# Altium project steve.PrjPcb (part 1 of 3)
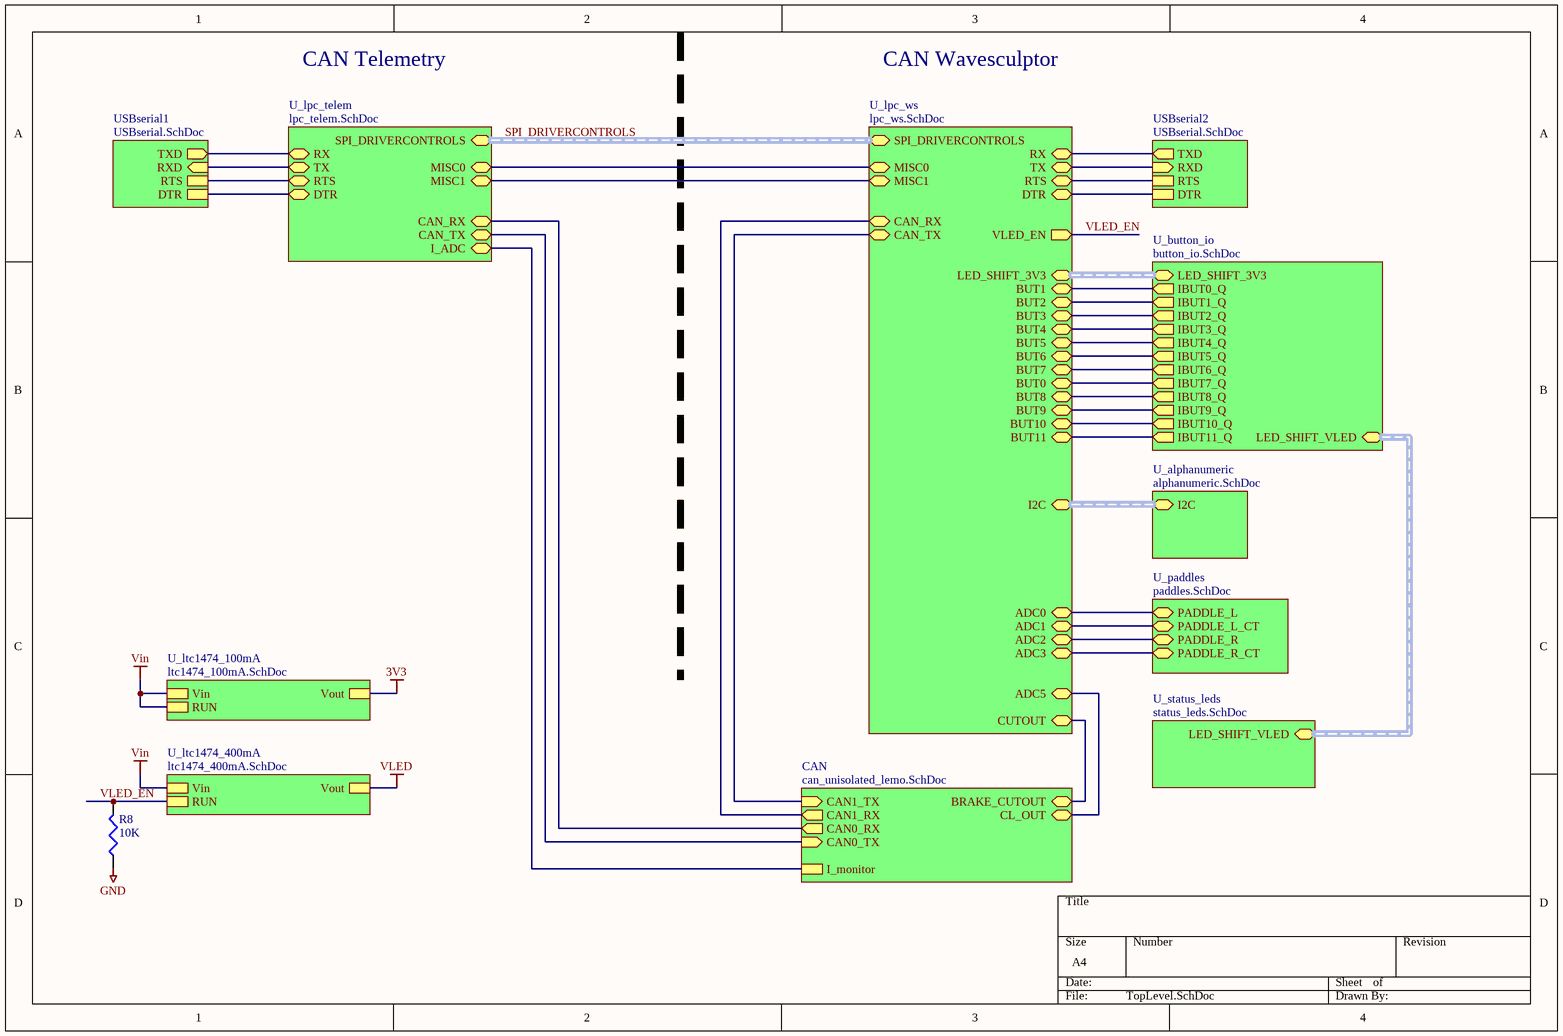
[diagram p0: TopLevel.SchDoc]
13 sheets, 286 parts. Net scope: hierarchical (ports join the sheet entries above them; power ports are global).
Board file: steve.PcbDoc
Sheets:
  TopLevel.SchDoc
    CAN = can_unisolated_lemo.SchDoc
    USBserial1 = USBserial.SchDoc
    USBserial2 = USBserial.SchDoc
    U_lpc_telem = lpc_telem.SchDoc
      U_lpc11c14 = lpc11c14.SchDoc
    U_lpc_ws = lpc_ws.SchDoc
      U_lpc11c14 = lpc11c14.SchDoc
    U_button_io = button_io.SchDoc
      U_IBUT0 = illuminated_button.SchDoc
      U_IBUT1 = illuminated_button.SchDoc
      U_IBUT2 = illuminated_button.SchDoc
      U_IBUT3 = illuminated_button.SchDoc
      U_IBUT4 = illuminated_button.SchDoc
      U_IBUT5 = illuminated_button.SchDoc
      U_IBUT6 = illuminated_button.SchDoc
      U_IBUT7 = illuminated_button.SchDoc
      U_IBUT8 = illuminated_button.SchDoc
      U_IBUT9 = illuminated_button.SchDoc
      U_IBUT10 = illuminated_button.SchDoc
      U_IBUT11 = illuminated_button.SchDoc
    U_alphanumeric = alphanumeric.SchDoc
    U_paddles = paddles.SchDoc
    U_ltc1474_100mA = ltc1474_100mA.SchDoc
    U_ltc1474_400mA = ltc1474_400mA.SchDoc
    U_status_leds = status_leds.SchDoc

## Sheet TopLevel.SchDoc
size A4

### Parts
R8  10K  [0603]

### Sub-sheets
CAN = can_unisolated_lemo.SchDoc: I_monitor, CAN0_TX (in), CAN0_RX (out), CAN1_TX (in), CAN1_RX (out), CL_OUT, BRAKE_CUTOUT
U_alphanumeric = alphanumeric.SchDoc: I2C (harness I2C)
U_button_io = button_io.SchDoc: LED_SHIFT_3V3 (harness LED_SHIFT), IBUT0_Q (out), IBUT1_Q (out), IBUT2_Q (out), IBUT3_Q (out), IBUT4_Q (out), IBUT5_Q (out), IBUT6_Q (out), IBUT7_Q (out), IBUT8_Q (out), IBUT9_Q (out), IBUT10_Q (out), IBUT11_Q (out), LED_SHIFT_VLED (harness LED_SHIFT_RET)
U_lpc_telem = lpc_telem.SchDoc: RX, TX, RTS, DTR, CAN_RX, CAN_TX, I_ADC, SPI_DRIVERCONTROLS (harness SPI), MISC0, MISC1
U_lpc_ws = lpc_ws.SchDoc: RX, TX, RTS, DTR, CAN_RX, CAN_TX, SPI_DRIVERCONTROLS (harness SPI), LED_SHIFT_3V3 (harness LED_SHIFT), VLED_EN (out), I2C (harness I2C), BUT1, BUT2, BUT3, BUT4, BUT5, BUT6, BUT7, BUT0, BUT8, BUT9, BUT10, BUT11, ADC0, ADC1, ADC2, ADC3, ADC5, CUTOUT, MISC0, MISC1
U_ltc1474_100mA = ltc1474_100mA.SchDoc: Vin, Vout, RUN
U_ltc1474_400mA = ltc1474_400mA.SchDoc: Vin, Vout, RUN
U_paddles = paddles.SchDoc: PADDLE_L, PADDLE_L_CT, PADDLE_R, PADDLE_R_CT
U_status_leds = status_leds.SchDoc: LED_SHIFT_VLED (harness LED_SHIFT_RET)
USBserial1 = USBserial.SchDoc: TXD (out), RXD (in), DTR, RTS
USBserial2 = USBserial.SchDoc: TXD (out), RXD (in), DTR, RTS

### Nets
GND: R8.1
Vin: sheet U_ltc1474_100mA/Vin, sheet U_ltc1474_100mA/RUN, sheet U_ltc1474_400mA/Vin
CAN_RX: sheet CAN/CAN0_RX, sheet U_lpc_telem/CAN_RX
CAN_RX: sheet CAN/CAN1_RX, sheet U_lpc_ws/CAN_RX  [a separate net that carries the same name]
CAN_TX: sheet CAN/CAN1_TX, sheet U_lpc_ws/CAN_TX
CAN_TX: sheet CAN/CAN0_TX, sheet U_lpc_telem/CAN_TX  [a separate net that carries the same name]
PIO 0.6: sheet U_lpc_ws/BUT9, sheet U_button_io/IBUT9_Q
PIO 0.7: sheet U_lpc_ws/BUT11, sheet U_button_io/IBUT11_Q
PIO 0.8/MISO0: sheet U_lpc_ws/BUT10, sheet U_button_io/IBUT10_Q
PIO 0.11/ADC0: sheet U_lpc_ws/ADC0, sheet U_paddles/PADDLE_L
PIO 1.0/ADC1: sheet U_lpc_ws/ADC1, sheet U_paddles/PADDLE_L_CT
PIO 1.1/ADC2: sheet U_lpc_ws/ADC2, sheet U_paddles/PADDLE_R
PIO 1.2/ADC3: sheet U_lpc_ws/ADC3, sheet U_paddles/PADDLE_R_CT
PIO 1.4/ADC5/WAKEUP: sheet CAN/CL_OUT, sheet U_lpc_ws/ADC5
PIO 1.5: sheet U_lpc_ws/BUT4, sheet U_button_io/IBUT3_Q
PIO 1.6/RX: sheet USBserial1/TXD, sheet U_lpc_telem/RX
PIO 1.6/RX: sheet USBserial2/TXD, sheet U_lpc_ws/RX  [a separate net that carries the same name]
PIO 1.7/TX: sheet USBserial1/RXD, sheet U_lpc_telem/TX
PIO 1.7/TX: sheet USBserial2/RXD, sheet U_lpc_ws/TX  [a separate net that carries the same name]
PIO 1.8: sheet U_lpc_ws/BUT5, sheet U_button_io/IBUT4_Q
PIO 1.9: sheet U_lpc_ws/BUT6, sheet U_button_io/IBUT5_Q
PIO 1.10/ADC6: sheet CAN/I_monitor, sheet U_lpc_telem/I_ADC
PIO 1.11/ADC7: sheet U_lpc_ws/BUT7, sheet U_button_io/IBUT6_Q
PIO 2.5: sheet U_lpc_ws/BUT0, sheet U_button_io/IBUT7_Q
PIO 2.6: sheet U_lpc_ws/BUT1, sheet U_button_io/IBUT0_Q
PIO 2.7: sheet U_lpc_ws/BUT2, sheet U_button_io/IBUT1_Q
PIO 2.8: sheet U_lpc_ws/BUT3, sheet U_button_io/IBUT2_Q
PIO 2.9: sheet CAN/BRAKE_CUTOUT, sheet U_lpc_ws/CUTOUT
PIO 2.10: sheet U_lpc_ws/BUT8, sheet U_button_io/IBUT8_Q
PIO 3.2: sheet U_lpc_telem/MISC0, sheet U_lpc_ws/MISC0
PIO 3.3: sheet U_lpc_telem/MISC1, sheet U_lpc_ws/MISC1
VLED_EN: R8.2 ; sheet U_lpc_ws/VLED_EN, sheet U_ltc1474_400mA/RUN
NetR2_U_lpc_telem_U_lpc11c14_1: sheet USBserial1/DTR, sheet U_lpc_telem/DTR
NetR2_U_lpc_ws_U_lpc11c14_1: sheet USBserial2/DTR, sheet U_lpc_ws/DTR
NetR4_U_lpc_telem_U_lpc11c14_1: sheet USBserial1/RTS, sheet U_lpc_telem/RTS
NetR4_U_lpc_ws_U_lpc11c14_1: sheet USBserial2/RTS, sheet U_lpc_ws/RTS

### Buses and harness runs
harness sheet U_alphanumeric/I2C = sheet U_lpc_ws/I2C
harness sheet U_button_io/LED_SHIFT_3V3 = sheet U_lpc_ws/LED_SHIFT_3V3
harness sheet U_button_io/LED_SHIFT_VLED = sheet U_status_leds/LED_SHIFT_VLED
harness SPI_DRIVERCONTROLS = sheet U_lpc_telem/SPI_DRIVERCONTROLS = sheet U_lpc_ws/SPI_DRIVERCONTROLS

### Notes on the sheet
- CAN Telemetry
- CAN Wavesculptor

### Library data of the parts
R8 = RES1: Resistor; Value: 1k; Needed?: NO - HW LAB

## Sheet can_unisolated_lemo.SchDoc
size A4; Organization: UNSW Solar Racing Team; Address3: UNSW; Address4: Sydney NSW 2052; Address2: Electrical Engineering; Address1: Rm 109
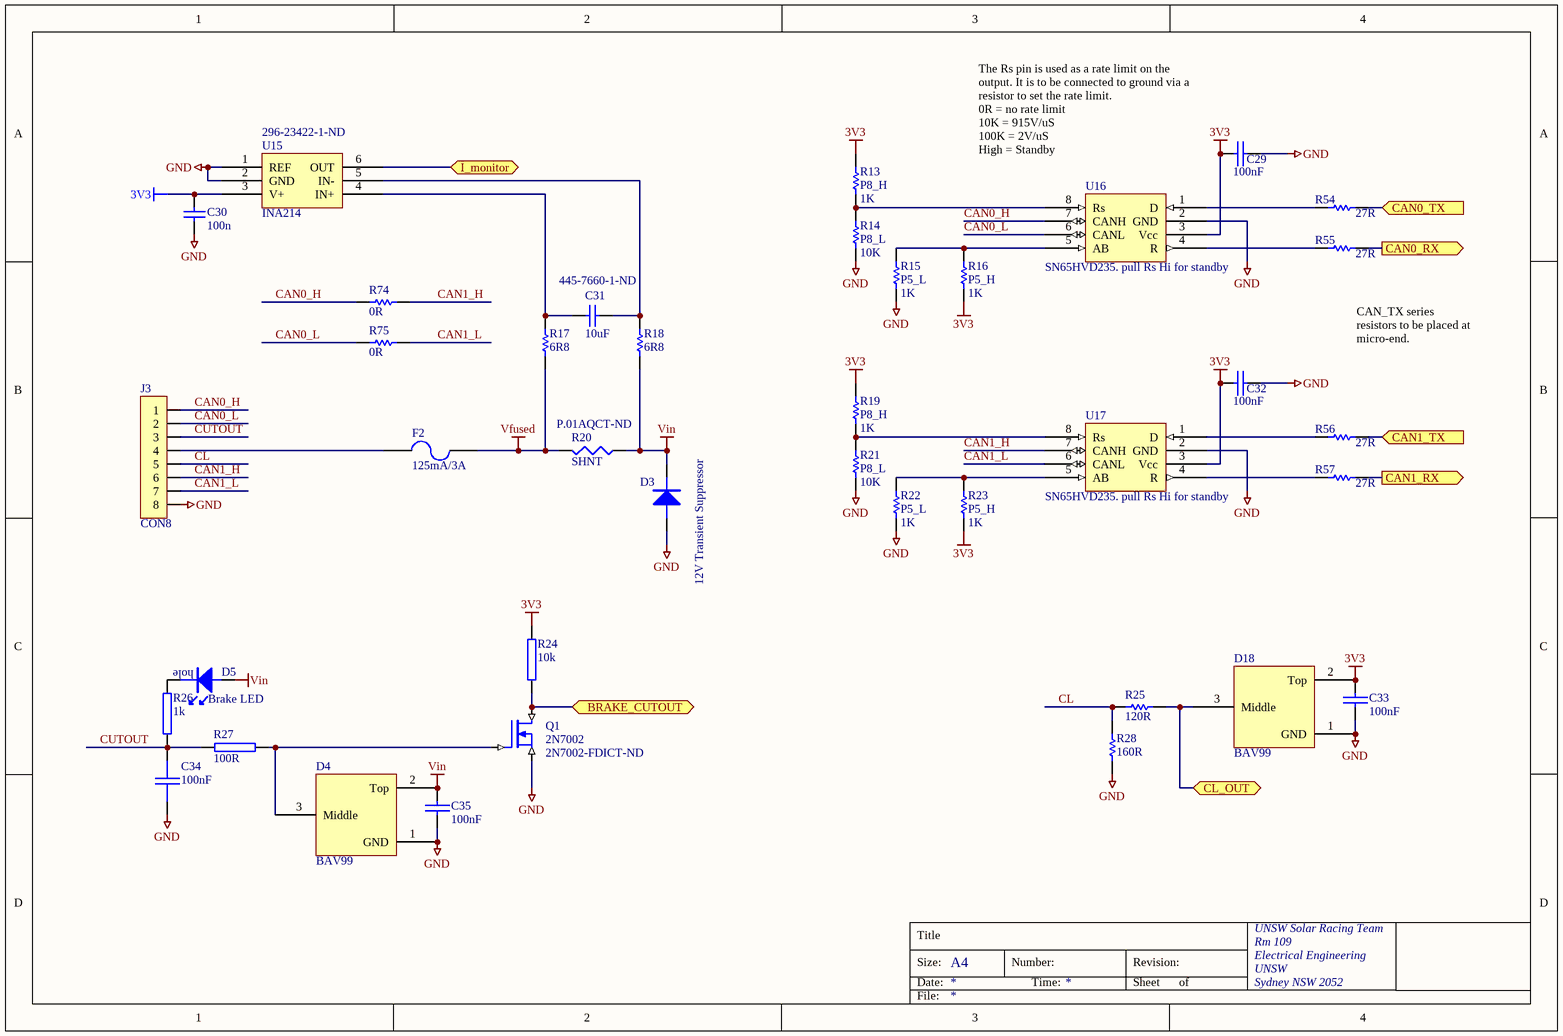
[diagram p1: can_unisolated_lemo.SchDoc]

### Parts
C29  100nF  [0603]
C30  100n  [0603]
C31  10uF  Supplier Part Number 1: 445-7660-1-ND  [0805]
C32  100nF  [0603]
C33  100nF  [0603]
C34  100nF  [0603]
C35  100nF  [0603]
D3  12V Transient Suppressor  [SMA]
D4  BAV99  [SOT23-3]
D5  Brake LED  [LED0.1]
D18  BAV99  [SOT23-3]
F2  125mA/3A  [LITTELFUSE-154]
J3  CON8  [LEMO_1B_308]
Q1  2N7002  Supplier Part Number 1: 2N7002-FDICT-ND  [SOT23-3]
R13  P8_H  value 1K  [0603]
R14  P8_L  value 10K  [0603]
R15  P5_L  value 1K  [0603]
R16  P5_H  value 1K  [0603]
R17  6R8  [0603]
R18  6R8  [0603]
R19  P8_H  value 1K  [0603]
R20  SHNT  Supplier Part Number 1: P.01AQCT-ND  [0805]
R21  P8_L  value 10K  [0603]
R22  P5_L  value 1K  [0603]
R23  P5_H  value 1K  [0603]
R24  10k  [0603]
R25  120R  [0603]
R26  1k  [0603]
R27  100R  [0603]
R28  160R  [0603]
R54  27R  [0603]
R55  27R  [0603]
R56  27R  [0603]
R57  27R  [0603]
R74  0R  [0603]
R75  0R  [0603]
U15  INA214  Supplier Part Number 1: 296-23422-1-ND  [SC70-6]
U16  SN65HVD235. pull Rs Hi for standby  [SO8]
U17  SN65HVD235. pull Rs Hi for standby  [SO8]

### Ports
BRAKE_CUTOUT, CAN0_RX (out), CAN0_TX (in), CAN1_RX (out), CAN1_TX (in), CL_OUT, I_monitor

### Nets
3V3: C29.2 C30.2 C32.2 C33.1 D18.2(Top) R13.2 R16.1 R19.2 R23.1 R24.2 U15.3(V+) U16.3(Vcc) U17.3(Vcc)
GND: C29.1 C30.1 C32.1 C33.2 C34.2 C35.2 D3.A D4.1(GND) D18.1(GND) J3.8 Q1.S R14.1 R15.1 R21.1 R22.1 R28.1 U15.1(REF) U15.2(GND) U16.2(GND) U17.2(GND)
Vfused: F2.2 R17.2 R20.2
Vin: C35.1 D3.K D4.2(Top) D5.A R18.2 R20.1
CAN0_H: J3.1 R74.1 U16.7(CANH)
CAN0_L: J3.2 R75.1 U16.6(CANL)
CAN1_H: J3.6 R74.2 U17.7(CANH)
CAN1_L: J3.7 R75.2 U17.6(CANL)
CAN_RX: R55.1 ; port CAN0_RX
CAN_RX: R57.1 ; port CAN1_RX  [a separate net that carries the same name]
CAN_TX: R56.1 ; port CAN1_TX
CAN_TX: R54.1 ; port CAN0_TX  [a separate net that carries the same name]
CL: J3.5 R25.2 R28.2
CUTOUT: C34.1 J3.3 R26.2 R27.1
PIO 1.4/ADC5/WAKEUP: D18.3(Middle) R25.1 ; port CL_OUT
PIO 1.10/ADC6: U15.6(OUT) ; port I_monitor
PIO 2.9: Q1.D R24.1 ; port BRAKE_CUTOUT
NetC31_1: C31.1 R17.1 U15.4(IN+)
NetC31_2: C31.2 R18.1 U15.5(IN-)
NetD4_3: D4.3(Middle) Q1.G R27.2
NetD5_K: D5.K R26.1
NetF2_1: F2.1 J3.4
NetR13_1: R13.1 R14.2 U16.8(Rs)
NetR15_2: R15.2 R16.2 U16.5(AB)
NetR19_1: R19.1 R21.2 U17.8(Rs)
NetR22_2: R22.2 R23.2 U17.5(AB)
NetR54_2: R54.2 U16.1(D)
NetR55_2: R55.2 U16.4(R)
NetR56_2: R56.2 U17.1(D)
NetR57_2: R57.2 U17.4(R)

### Notes on the sheet
- The Rs pin is used as a rate limit on the output. It is to be connected to ground via a resistor to set the rate limit.
  0R = no rate limit
  10K = 915V/uS
  100K = 2V/uS
  High = Standby
- CAN_TX series resistors to be placed at micro-end.
- Title
- Size:
- Date:
- A4
- Number:
- Time:
- Revision:
- Sheet
- of
- File:
- (in symbol LED_HOLE) hole

### Library data of the parts
C29 C32 C33 C35 = CAP: Capacitor; Farnell: 753-567; Price: 0.31
C30 = Cap Semi: Capacitor (Semiconductor SIM Model); Value: 100nF; Published: 8-Jun-2000; LatestRevisionDate: 17-Jul-2002; LatestRevisionNote: Re-released for DXP Platform.; PackageReference: C1206; Publisher: Altium Limited; Element14: 9406140; Element14 Price: 0.13
C31 = Cap Semi: Capacitor (Semiconductor SIM Model); Manufacturer: TDK Corporation; Manufacturer Part Number: C2012X5R1A106K125AB; Description: CAP CER 10UF 10V 10% X5R 0805; Capacitance: 10µF; Voltage - Rated: 10V; Tolerance: ±10%; Temperature Coefficient: X5R; Value: 10uF; Element14: 1458902RL; Element14 Price: 0.69; Supplier 1: Digi-Key; RoHS: RoHS Compliant; Category: Capacitors; Stock 1: 260840; Pricing 1: 1=0.24, 10=0.163, 100=0.0833, 250=0.06744, 500=0.05948, 1000=0.05057 (AUD); Packaging: Cut Tape (CT); Mounting Type: Surface Mount, MLCC; Operating Temperature: -55°C ~ 85°C; Applications: General Purpose; Ratings: -; Package / Case: 0805 (2012 Metric); Size / Dimension: 0.079" L x 0.049" W (2.00mm x 1.25mm); Height - Seated (Max): -; Thickness (Max): 0.057" (1.45mm); Lead Spacing: -; Features: -; Lead Style: -; ComponentLink1URL: http://product.tdk.com/capacitor/mlcc/en/documents/mlcc_commercial_general_en.pdf; ComponentLink1Description: http://product.tdk.com/capacitor/mlcc/en/documents/mlcc_commercial_general_en.pdf
C34 = CAP: Capacitor; Value: 0.1uF; Revision: July-2002: Re-released for DXP Platform.; Farnell: 753-567; Price: 0.31
D3 = DIODE: Farnell: 302-3096; Price: 1.25
D4 D18 = BAV99: Dual Diode
D5 = LED_HOLE: through hole LED
F2 = FUSE2: Fuse; Farnell: 664-893; Other Info: www.littelfuse.com; Price: 5.67
J3 = CON8: Connector
Q1 = N-MOSFET: pin to pad: D>3 G>1 S>2; Manufacturer: Diodes Inc; Manufacturer Part Number: 2N7002-7-F; Description: MOSFET N-CH 60V 115MA SOT23-3; FET Type: MOSFET N-Channel, Metal Oxide; FET Feature: Standard; Drain to Source Voltage (Vdss): 60V; Current - Continuous Drain (Id) @ 25° C: 115mA (Ta); Rds On (Max) @ Id, Vgs: 7.5 Ohm @ 50mA, 5V; Vgs(th) (Max) @ Id: 2.5V @ 250µA; Input Capacitance (Ciss) @ Vds: 50pF @ 25V; Power - Max: 300mW; Farnell: 518-402; Price: 0.62; Supplier 1: Digi-Key; RoHS: RoHS Compliant; Category: Discrete Semiconductor Products; Stock 1: 120849; Pricing 1: 1=0.18, 10=0.171, 25=0.1548, 100=0.1114, 250=0.0656, 500=0.05444, 1000=0.03714 (AUD); Packaging: Cut Tape (CT); Gate Charge (Qg) @ Vgs: -; Mounting Type: Surface Mount; Package / Case: TO-236-3, SC-59, SOT-23-3; Supplier Device Package: SOT-23-3; ComponentLink1URL: http://www.diodes.com/datasheets/ds11303.pdf; ComponentLink1Description: http://www.diodes.com/datasheets/ds11303.pdf
R13-R16 R19 R21-R23 = Res Semi: Semiconductor Resistor; Published: 8-Jun-2000; LatestRevisionDate: 17-Jul-2002; LatestRevisionNote: Re-released for DXP Platform.; PackageReference: AXIAL-0.5; Publisher: Altium Limited; PackageDescription: Axial Device, Thru-Hole; 2 Leads; 0.5 in Pin Spacing
R17 R18 = Res Semi: Semiconductor Resistor; Manufacturer: Panasonic Electronic Components; Manufacturer Part Number: ERJ-3GEYJ6R8V; Description: RES 6.8 OHM 1/10W 5% 0603 SMD; Resistance (Ohms): 6.8; Power (Watts): 0.1W, 1/10W; Temperature Coefficient: -100/ +600ppm/°C; Tolerance: ±5%; Published: 8-Jun-2000; LatestRevisionDate: 17-Jul-2002; LatestRevisionNote: Re-released for DXP Platform.; PackageReference: AXIAL-0.5; Publisher: Altium Limited; Value: 6R8; Element14: 9331492RL; Element14 Price: 0.08 (min order 50); Supplier 1: Digi-Key; Supplier Part Number 1: P6.8GCT-ND; RoHS: RoHS Compliant; Category: Resistors; Stock 1: 133530; Pricing 1: 1=0.12, 50=0.011, 100=0.0084, 250=0.00624, 500=0.00462, 1000=0.00308 (AUD); Packaging: Cut Tape (CT); Composition: Thick Film; Features: -; Package / Case: 0603 (1608 Metric); Supplier Device Package: 0603; Size / Dimension: 0.063" L x 0.031" W (1.60mm x 0.80mm); Height: 0.022" (0.55mm); Number of Terminations: 2; ComponentLink1URL: http://industrial.panasonic.com/www-cgi/jvcr13pz.cgi?E+PZ+3+AOA0001+ERJ3GEYJ6R8V+7+WW; ComponentLink1Description: http://industrial.panasonic.com/www-cgi/jvcr13pz.cgi?E+PZ+3+AOA0001+ERJ3GEYJ6R8V+7+WW
R20 = Res3: Resistor; Manufacturer: Panasonic Electronic Components; Manufacturer Part Number: ERJ-6BWFR010V; Description: RES 0.01 OHM 1/2W 1% 0805 SMD; Resistance (Ohms): 0.01; Power (Watts): 0.5W, 1/2W; Temperature Coefficient: ±300ppm/°C; Tolerance: ±1%; Publisher: Altium Limited; Element14: 8067520; Element14 Price: 0.62; Supplier 1: Digi-Key; RoHS: RoHS Compliant; Category: Resistors; Stock 1: 6983; Pricing 1: 1=1.38, 50=0.7394, 100=0.6469, 250=0.573, 500=0.48058, 1000=0.36967 (AUD); Packaging: Cut Tape (CT); Composition: Thick Film; Features: -; Package / Case: 0805 (2012 Metric); Supplier Device Package: 0805; Size / Dimension: 0.079" L x 0.049" W (2.00mm x 1.25mm); Height: 0.030" (0.75mm); Number of Terminations: 2; ComponentLink1URL: http://industrial.panasonic.com/www-data/pdf/AOA0000/AOA0000CE3.pdf; ComponentLink1Description: http://industrial.panasonic.com/www-data/pdf/AOA0000/AOA0000CE3.pdf
R24 = RES: Standard Resistor; Farnell: 612-601; Price: 0.11; Value: 10k
R25 = Res Semi: Semiconductor Resistor; Manufacturer: Panasonic Electronic Components; Manufacturer Part Number: ERJ-3EKF1200V; Value: 6R8; Description: RES 120 OHM 1/10W 1% 0603 SMD; Resistance (Ohms): 120; Power (Watts): 0.1W, 1/10W; Temperature Coefficient: ±100ppm/°C; Tolerance: ±1%; Published: 8-Jun-2000; LatestRevisionDate: 17-Jul-2002; LatestRevisionNote: Re-released for DXP Platform.; PackageReference: AXIAL-0.5; Publisher: Altium Limited; Element14: 9331492RL; Element14 Price: 0.08 (min order 50); Supplier 1: Digi-Key; Supplier Part Number 1: P120HCT-ND; RoHS: RoHS Compliant; Category: Resistors; Stock 1: 359454; Pricing 1: 1=0.12, 50=0.0166, 100=0.0126, 250=0.00936, 500=0.00692, 1000=0.00461 (AUD); Packaging: Cut Tape (CT); Composition: Thick Film; Features: -; Package / Case: 0603 (1608 Metric); Supplier Device Package: 0603; Size / Dimension: 0.063" L x 0.031" W (1.60mm x 0.80mm); Height: 0.022" (0.55mm); Number of Terminations: 2; ComponentLink1URL: http://industrial.panasonic.com/www-cgi/jvcr13pz.cgi?E+PZ+3+AOA0002+ERJ3EKF1200V+7+WW; ComponentLink1Description: http://industrial.panasonic.com/www-cgi/jvcr13pz.cgi?E+PZ+3+AOA0002+ERJ3EKF1200V+7+WW
R26 R27 = RES: Standard Resistor; Value: 10k; Farnell: 612-601; Price: 0.11
R28 = Res Semi: Semiconductor Resistor; Manufacturer: Panasonic Electronic Components; Manufacturer Part Number: ERJ-2RKF1600X; Value: 6R8; Description: RES 160 OHM 1/10W 1% 0402 SMD; Resistance (Ohms): 160; Power (Watts): 0.1W, 1/10W; Temperature Coefficient: ±100ppm/°C; Tolerance: ±1%; Published: 8-Jun-2000; LatestRevisionDate: 17-Jul-2002; LatestRevisionNote: Re-released for DXP Platform.; PackageReference: AXIAL-0.5; Publisher: Altium Limited; Element14: 9331492RL; Element14 Price: 0.08 (min order 50); Supplier 1: Digi-Key; Supplier Part Number 1: P160LCT-ND; RoHS: RoHS Compliant; Category: Resistors; Stock 1: 47882; Pricing 1: 1=0.12, 50=0.029, 100=0.0221, 250=0.0164, 500=0.01212, 1000=0.00808, 5000=0.00568 (AUD); Packaging: Cut Tape (CT); Composition: Thick Film; Features: -; Package / Case: 0402 (1005 Metric); Supplier Device Package: 0402; Size / Dimension: 0.039" L x 0.020" W (1.00mm x 0.50mm); Height: 0.016" (0.40mm); Number of Terminations: 2; ComponentLink1URL: http://industrial.panasonic.com/www-cgi/jvcr13pz.cgi?E+PZ+3+AOA0002+ERJ2RKF1600X+7+WW; ComponentLink1Description: http://industrial.panasonic.com/www-cgi/jvcr13pz.cgi?E+PZ+3+AOA0002+ERJ2RKF1600X+7+WW
R54-R57 = Res Semi: Semiconductor Resistor; Manufacturer: Panasonic Electronic Components; Manufacturer Part Number: ERJ-3EKF27R0V; Value: 1K; Description: RES 27 OHM 1/10W 1% 0603 SMD; Resistance (Ohms): 27; Power (Watts): 0.1W, 1/10W; Temperature Coefficient: ±100ppm/°C; Tolerance: ±1%; Published: 8-Jun-2000; LatestRevisionDate: 17-Jul-2002; LatestRevisionNote: Re-released for DXP Platform.; PackageReference: AXIAL-0.5; Publisher: Altium Limited; PackageDescription: Axial Device, Thru-Hole; 2 Leads; 0.5 in Pin Spacing; Supplier 1: Digi-Key; Supplier Part Number 1: P27.0HCT-ND; RoHS: RoHS Compliant; Category: Resistors; Stock 1: 89523; Pricing 1: 1=0.12, 50=0.0166, 100=0.0126, 250=0.00936, 500=0.00692, 1000=0.00461 (AUD); Packaging: Cut Tape (CT); Composition: Thick Film; Features: -; Package / Case: 0603 (1608 Metric); Supplier Device Package: 0603; Size / Dimension: 0.063" L x 0.031" W (1.60mm x 0.80mm); Height: 0.022" (0.55mm); Number of Terminations: 2; ComponentLink1URL: http://industrial.panasonic.com/www-cgi/jvcr13pz.cgi?E+PZ+3+AOA0002+ERJ3EKF27R0V+7+WW; ComponentLink1Description: http://industrial.panasonic.com/www-cgi/jvcr13pz.cgi?E+PZ+3+AOA0002+ERJ3EKF27R0V+7+WW
R74 R75 = Res Semi: Semiconductor Resistor; Value: 6R8; Published: 8-Jun-2000; LatestRevisionDate: 17-Jul-2002; LatestRevisionNote: Re-released for DXP Platform.; PackageReference: AXIAL-0.5; Publisher: Altium Limited; Element14: 9331492RL; Element14 Price: 0.08 (min order 50)
U15 = INA214: Current Shunt Monitor; Manufacturer: Texas Instruments; Manufacturer Part Number: INA214AIDCKT; Description: IC CURRENT MONITOR 1% SC70-6; Function: Current Monitor; Sensing Method: High/Low-Side; Accuracy: ±1%; Voltage - Input: 2.7 V ~ 26 V; Element14: 1754262; Element14 Price: $4.22; Supplier 1: Digi-Key; RoHS: RoHS Compliant; Category: Integrated Circuits (ICs); Stock 1: 2023; Pricing 1: 1=2.58, 10=2.336, 25=2.0932, 100=1.0952 (AUD); Packaging: Cut Tape (CT); Current - Output: -; Operating Temperature: -40°C ~ 125°C; Mounting Type: Surface Mount; Package / Case: 6-TSSOP, SC-88, SOT-363; Supplier Device Package: SC-70-6; ComponentLink1URL: http://www.ti.com/lit/ds/symlink/ina210.pdf; ComponentLink1Description: http://www.ti.com/lit/ds/symlink/ina210.pdf
U16 U17 = SN65HVD235: 3.3V CAN XCVR W/STANDBY

## Sheet USBserial.SchDoc
size A4
Used 2 times, as channels USBserial1, USBserial2. Parts and nets are listed once, with the designators drawn on the sheet.
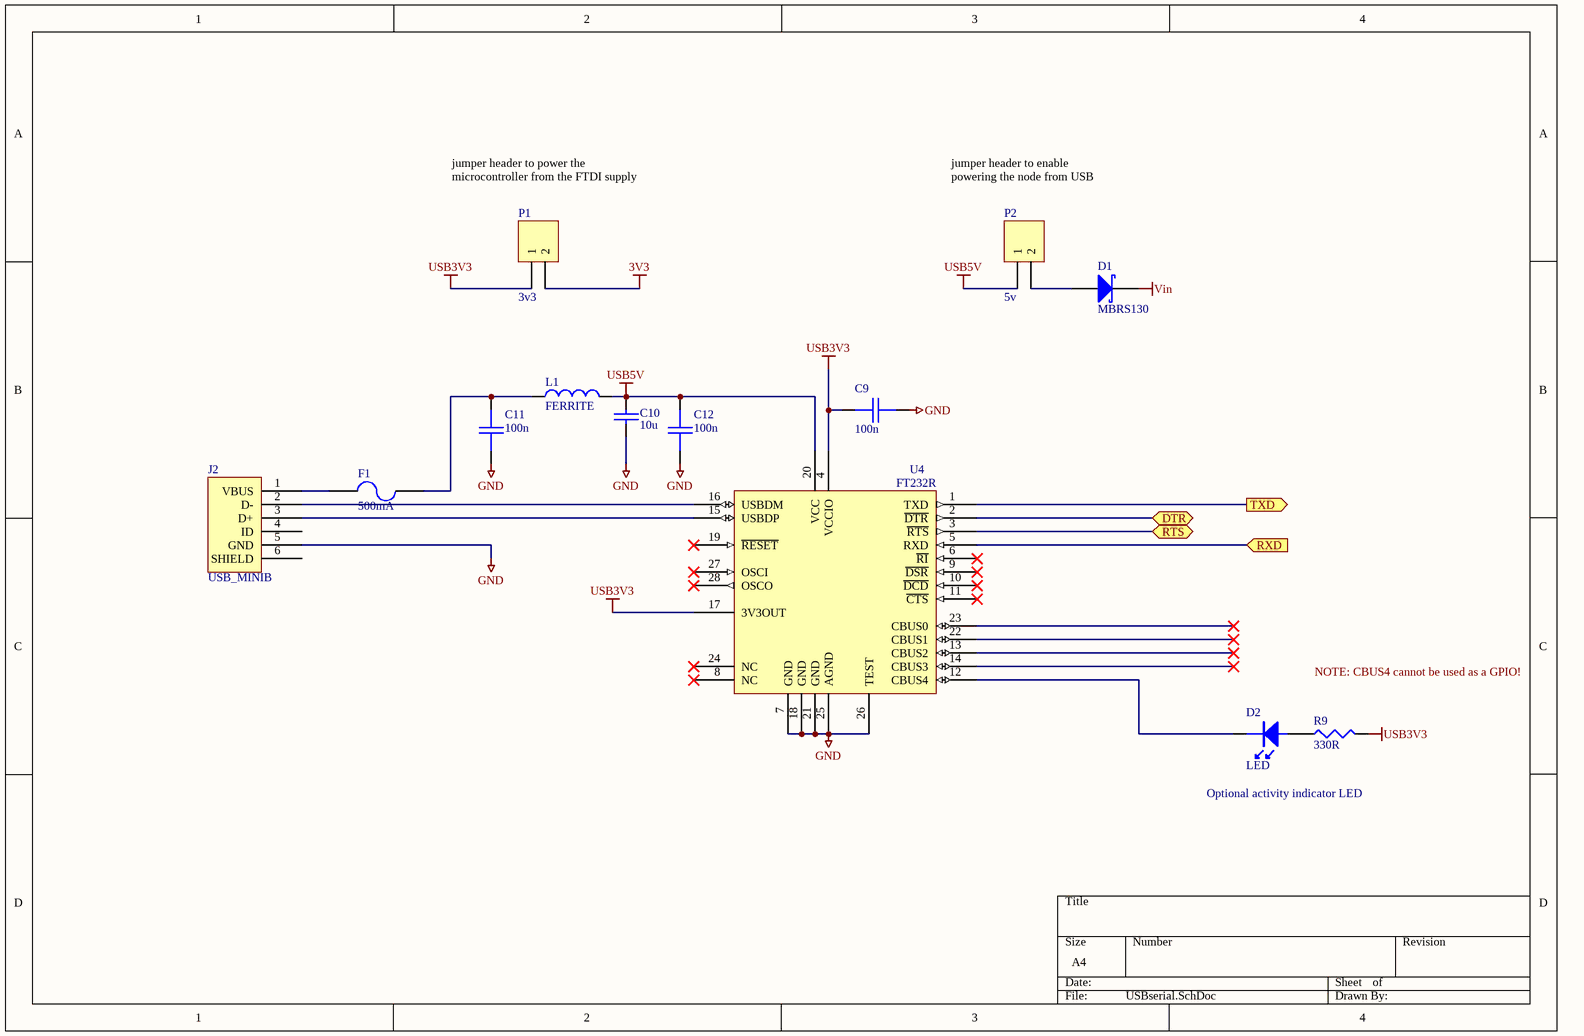
[diagram p2: USBserial.SchDoc]

### Parts
C9  100n  [0603]
C10  10u  [0805]
C11  100n  [0603]
C12  100n  [0603]
D1  MBRS130  [SMB]
D2  LED  [0805LED]
F1  500mA  [1812]
J2  USB_MINIB  [USB_MINIB_UX60SC]
L1  FERRITE  [0805]
P1  3v3  [HDR1X2]
P2  5v  [HDR1X2]
R9  330R  [0603]
U4  FT232R  [SSOP28w]

### Ports
DTR, RTS, RXD (in), TXD (out)

### Nets
3V3: P1.2
GND: C9.2 C10.1 C11.2 C12.2 J2.5(GND) U4.7(GND) U4.18(GND) U4.21(GND) U4.25(AGND) U4.26(TEST)
USB3V3: C9.1 P1.1 R9.2 U4.4(VCCIO) U4.17(3V3OUT)
USB5V: C10.2 C12.1 L1.2 P2.1 U4.20(VCC)
Vin: D1.K
DTR: U4.2(~{DTR}) ; port DTR
RTS: U4.3(~{RTS}) ; port RTS
RXD: U4.5(RXD) ; port RXD
TXD: U4.1(TXD) ; port TXD
NetC11_1: C11.1 F1.2 L1.1
NetD1_A: D1.A P2.2
NetD2_A: D2.A R9.1
NetD2_K: D2.K U4.12(CBUS4)
NetF1_1: F1.1 J2.1(VBUS)
NetJ2_2: J2.2(D-) U4.16(USBDM)
NetJ2_3: J2.3(D+) U4.15(USBDP)

Not connected (* = marked no-connect by the designer): J2 4(ID) 6(SHIELD); U4 6(~{RI})* 8(NC)* 9(~{DSR})* 10(~{DCD})* 11(~{CTS})* 13(CBUS2)* 14(CBUS3)* 19(~{RESET})* 22(CBUS1)* 23(CBUS0)* 24(NC)* 27(OSCI)* 28(OSCO)*

### Channels
USBserial1: designators end in _USBserial1; ports DTR=NetR2_U_lpc_telem_U_lpc11c14_1 RTS=NetR4_U_lpc_telem_U_lpc11c14_1 RXD=PIO 1.7/TX TXD=PIO 1.6/RX
USBserial2: designators end in _USBserial2; ports DTR=NetR2_U_lpc_ws_U_lpc11c14_1 RTS=NetR4_U_lpc_ws_U_lpc11c14_1 RXD=PIO 1.7/TX TXD=PIO 1.6/RX

### Notes on the sheet
- jumper header to power the microcontroller from the FTDI supply
- jumper header to enable powering the node from USB
- NOTE: CBUS4 cannot be used as a GPIO!
- Optional activity indicator LED

### Library data of the parts
C9-C12 = CAP: Capacitor
  C9 C11 C12: Element14: 9406140; Element14 Price: 0.13
  C10: Element14: 1458902RL; Element14 Price: 0.69
D1 = D SCHOTTKY: Schottky Diode; Revision: July-2002: Re-released for DXP Platform.; Element14: 9556931; Element14 Price: 0.43; Digikey: MBRS130LT3GOSCT-ND; Digikey Price: 0.311
F1 = FUSE2: Fuse; Element14 Price: 4.60 (min 10); Element14 (low stock): 9943625(holder+fuse); Digikey: F1301CT-ND(holder+fuse); Digikey Price: 3.96
J2 = USB_miniB_SMT: USB Mini B Connector; Element14: 9786473; Element14 Price: $3.08
L1 = INDUCTOR: Manufacturer: Generic Components; Revision: July-2002: Re-released for DXP Platform.; Element14: 1308773; Element14 Price: 0.72
P1 P2 = Header 2: Header, 2-Pin; LatestRevisionDate: 17-Jul-2002; LatestRevisionNote: Re-released for DXP Platform.; Publisher: Altium Limited
R9 = RES1: Resistor

## Sheet lpc_telem.SchDoc
size A4
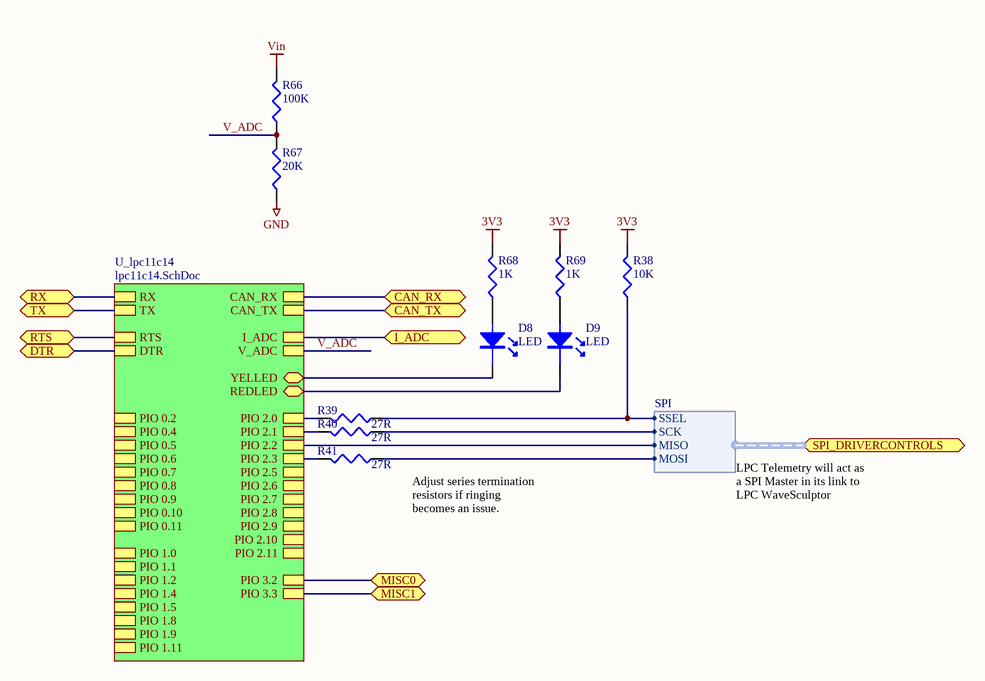
[diagram p3: lpc_telem.SchDoc]

### Parts
D8  LED  [0805LED]
D9  LED  [0805LED]
R38  10K  [0603]
R39  27R  [0603]
R40  27R  [0603]
R41  27R  [0603]
R66  100K  [0603]
R67  20K  [0603]
R68  1K  [0603]
R69  1K  [0603]

### Sub-sheets
U_lpc11c14 = lpc11c14.SchDoc: TX, RX, CAN_RX, CAN_TX, RTS, DTR, YELLED (bidir), REDLED (bidir), I_ADC, V_ADC, PIO 2.1, PIO 2.5, PIO 2.9, PIO 2.10, PIO 2.2, PIO 0.8, PIO 0.9, PIO 0.10, PIO 2.11, PIO 0.11, PIO 1.0, PIO 1.1, PIO 1.2, PIO 2.3, PIO 1.4, PIO 3.2, PIO 1.5, PIO 3.3, PIO 0.2, PIO 0.4, PIO 0.5, PIO 0.6, PIO 0.7, PIO 2.6, PIO 2.0, PIO 2.7, PIO 2.8, PIO 1.8, PIO 1.9, PIO 1.11

### Ports
CAN_RX, CAN_TX, DTR, I_ADC, MISC0, MISC1, RTS, RX, SPI_DRIVERCONTROLS (harness SPI), TX

### Harnesses
SPI: SSEL, SCK, MOSI, MISO

### Nets
3V3: R38.2 R68.2 R69.2
GND: R67.1
Vin: R66.2
CAN_RX: port CAN_RX, sheet U_lpc11c14/CAN_RX
CAN_TX: port CAN_TX, sheet U_lpc11c14/CAN_TX
PIO 1.6/RX: port RX, sheet U_lpc11c14/RX
PIO 1.7/TX: port TX, sheet U_lpc11c14/TX
PIO 1.10/ADC6: port I_ADC, sheet U_lpc11c14/I_ADC
PIO 2.0/SSEL1: R38.1 R39.1 ; port SPI_DRIVERCONTROLS.SSEL
PIO 2.0/SSEL1: R39.2 ; sheet U_lpc11c14/PIO 2.0  [a separate net that carries the same name]
PIO 2.1/SCK1: R40.1 ; port SPI_DRIVERCONTROLS.SCK
PIO 2.1/SCK1: R40.2 ; sheet U_lpc11c14/PIO 2.1  [a separate net that carries the same name]
PIO 2.2/MISO1: sheet U_lpc11c14/PIO 2.2, port SPI_DRIVERCONTROLS.MISO
PIO 2.3/MOSI1: R41.1 ; port SPI_DRIVERCONTROLS.MOSI
PIO 2.3/MOSI1: R41.2 ; sheet U_lpc11c14/PIO 2.3  [a separate net that carries the same name]
PIO 3.0: D9.K ; sheet U_lpc11c14/REDLED
PIO 3.1: D8.K ; sheet U_lpc11c14/YELLED
PIO 3.2: port MISC0, sheet U_lpc11c14/PIO 3.2
PIO 3.3: port MISC1, sheet U_lpc11c14/PIO 3.3
V_ADC: R66.1 R67.2 ; sheet U_lpc11c14/V_ADC  [project net PIO 1.3/ADC4]
NetD8_A: D8.A R68.1
NetD9_A: D9.A R69.1
NetR2_U_lpc_telem_U_lpc11c14_1: port DTR, sheet U_lpc11c14/DTR
NetR4_U_lpc_telem_U_lpc11c14_1: port RTS, sheet U_lpc11c14/RTS

### Notes on the sheet
- Adjust series termination resistors if ringing becomes an issue.
- LPC Telemetry will act as a SPI Master in its link to LPC WaveSculptor

### Library data of the parts
D8 = LED: Manufacturer: OSRAM Opto Semiconductors Inc; Manufacturer Part Number: LY R976-PS-36; Description: LED CHIPLED 588NM YLW 0805 SMD; Color: Yellow; Millicandela Rating: 162.5mcd; Voltage - Forward (Vf) Typ: 2V; Current - Test: 20mA; Wavelength - Dominant: 588nm; Wavelength - Peak: 591nm; Viewing Angle: 160°; Lens Type: Diffused; Lens Style/Size: Rectangle with Flat Top, 1.3mm x 1.25mm; Luminous Flux @ Current - Test: 520 mlm; Supplier 1: Digi-Key; Supplier Part Number 1: 475-2560-1-ND; RoHS: RoHS Compliant; Category: Optoelectronics; Stock 1: 42136; Pricing 1: 1=0.14, 10=0.112, 100=0.0892, 250=0.07804, 500=0.07132 (AUD); Packaging: Cut Tape (CT); Package / Case: 0805 (2012 Metric); Size / Dimension: 2.00mm L x 1.25mm W; Height: 0.80mm; Mounting Type: Surface Mount; ComponentLink1URL: http://catalog.osram-os.com/jsp/download.jsp?name=LO_LS_LY_R976.pdf&url=/media/_en/Graphics/00042116_0.pdf; ComponentLink1Description: http://catalog.osram-os.com/jsp/download.jsp?name=LO_LS_LY_R976.pdf&url=/media/_en/Graphics/00042116_0.pdf
D9 = LED: Manufacturer: OSRAM Opto Semiconductors Inc; Manufacturer Part Number: LS R976-NR-1; Description: LED CHIPLED 633NM RED 0805 SMD; Color: Red; Millicandela Rating: 104mcd; Voltage - Forward (Vf) Typ: 2V; Current - Test: 20mA; Wavelength - Dominant: 633nm; Wavelength - Peak: 645nm; Viewing Angle: 160°; Lens Type: Diffused; Lens Style/Size: Rectangle with Flat Top, 1.3mm x 1.25mm; Luminous Flux @ Current - Test: 330 mlm; Supplier 1: Digi-Key; Supplier Part Number 1: 475-1278-1-ND; RoHS: RoHS Compliant; Category: Optoelectronics; Stock 1: 53912; Pricing 1: 1=0.14, 10=0.112, 100=0.0892, 250=0.07804, 500=0.07132 (AUD); Packaging: Cut Tape (CT); Package / Case: 0805 (2012 Metric); Size / Dimension: 2.00mm L x 1.25mm W; Height: 0.80mm; Mounting Type: Surface Mount; ComponentLink1URL: http://catalog.osram-os.com/jsp/download.jsp?name=LO_LS_LY_R976.pdf&url=/media/_en/Graphics/00042116_0.pdf; ComponentLink1Description: http://catalog.osram-os.com/jsp/download.jsp?name=LO_LS_LY_R976.pdf&url=/media/_en/Graphics/00042116_0.pdf
R38 R68 R69 = RES1: Resistor
R39-R41 = RES1: Resistor; Manufacturer: Panasonic Electronic Components; Manufacturer Part Number: ERJ-3EKF27R0V; Description: RES 27 OHM 1/10W 1% 0603 SMD; Resistance (Ohms): 27; Power (Watts): 0.1W, 1/10W; Temperature Coefficient: ±100ppm/°C; Tolerance: ±1%; Supplier 1: Digi-Key; Supplier Part Number 1: P27.0HCT-ND; RoHS: RoHS Compliant; Category: Resistors; Stock 1: 89523; Pricing 1: 1=0.12, 50=0.0166, 100=0.0126, 250=0.00936, 500=0.00692, 1000=0.00461 (AUD); Packaging: Cut Tape (CT); Composition: Thick Film; Features: -; Package / Case: 0603 (1608 Metric); Supplier Device Package: 0603; Size / Dimension: 0.063" L x 0.031" W (1.60mm x 0.80mm); Height: 0.022" (0.55mm); Number of Terminations: 2; ComponentLink1URL: http://industrial.panasonic.com/www-cgi/jvcr13pz.cgi?E+PZ+3+AOA0002+ERJ3EKF27R0V+7+WW; ComponentLink1Description: http://industrial.panasonic.com/www-cgi/jvcr13pz.cgi?E+PZ+3+AOA0002+ERJ3EKF27R0V+7+WW
R66 = RES1: Resistor; Manufacturer: Panasonic Electronic Components; Manufacturer Part Number: ERJ-3EKF1003V; Needed?: NO - HW LAB; Description: RES 100K OHM 1/10W 1% 0603 SMD; Power (Watts): 0.1W, 1/10W; Temperature Coefficient: ±100ppm/°C; Tolerance: ±1%; Value: 100k; Supplier 1: Digi-Key; Supplier Part Number 1: P100KHCT-ND; RoHS: RoHS Compliant; Category: Resistors; Stock 1: 8186012; Pricing 1: 1=0.12, 50=0.0166, 100=0.0126, 250=0.00936, 500=0.00692, 1000=0.00461 (AUD); Packaging: Cut Tape (CT); Resistance (Ohms): 100k; Composition: Thick Film; Features: -; Package / Case: 0603 (1608 Metric); Supplier Device Package: 0603; Size / Dimension: 0.063" L x 0.031" W (1.60mm x 0.80mm); Height: 0.022" (0.55mm); Number of Terminations: 2; ComponentLink1URL: http://industrial.panasonic.com/www-cgi/jvcr13pz.cgi?E+PZ+3+AOA0002+ERJ3EKF1003V+7+WW; ComponentLink1Description: http://industrial.panasonic.com/www-cgi/jvcr13pz.cgi?E+PZ+3+AOA0002+ERJ3EKF1003V+7+WW
R67 = RES1: Resistor; Manufacturer: Panasonic Electronic Components; Manufacturer Part Number: ERJ-3EKF2002V; Needed?: NO - HW LAB; Description: RES 20K OHM 1/10W 1% 0603 SMD; Power (Watts): 0.1W, 1/10W; Temperature Coefficient: ±100ppm/°C; Tolerance: ±1%; Value: 20k; Supplier 1: Digi-Key; Supplier Part Number 1: P20.0KHCT-ND; RoHS: RoHS Compliant; Category: Resistors; Stock 1: 1656647; Pricing 1: 1=0.12, 50=0.0166, 100=0.0126, 250=0.00936, 500=0.00692, 1000=0.00461 (AUD); Packaging: Cut Tape (CT); Resistance (Ohms): 20k; Composition: Thick Film; Features: -; Package / Case: 0603 (1608 Metric); Supplier Device Package: 0603; Size / Dimension: 0.063" L x 0.031" W (1.60mm x 0.80mm); Height: 0.022" (0.55mm); Number of Terminations: 2; ComponentLink1URL: http://industrial.panasonic.com/www-cgi/jvcr13pz.cgi?E+PZ+3+AOA0002+ERJ3EKF2002V+7+WW; ComponentLink1Description: http://industrial.panasonic.com/www-cgi/jvcr13pz.cgi?E+PZ+3+AOA0002+ERJ3EKF2002V+7+WW

## Sheet lpc11c14.SchDoc
size A4; Organization: UNSW Solar Racing Team; Address3: UNSW; Address4: Sydney NSW 2052; Address2: Electrical Engineering; Address1: Rm 109
Used 2 times, as channels U_lpc_telem/U_lpc11c14, U_lpc_ws/U_lpc11c14. Parts and nets are listed once, with the designators drawn on the sheet.
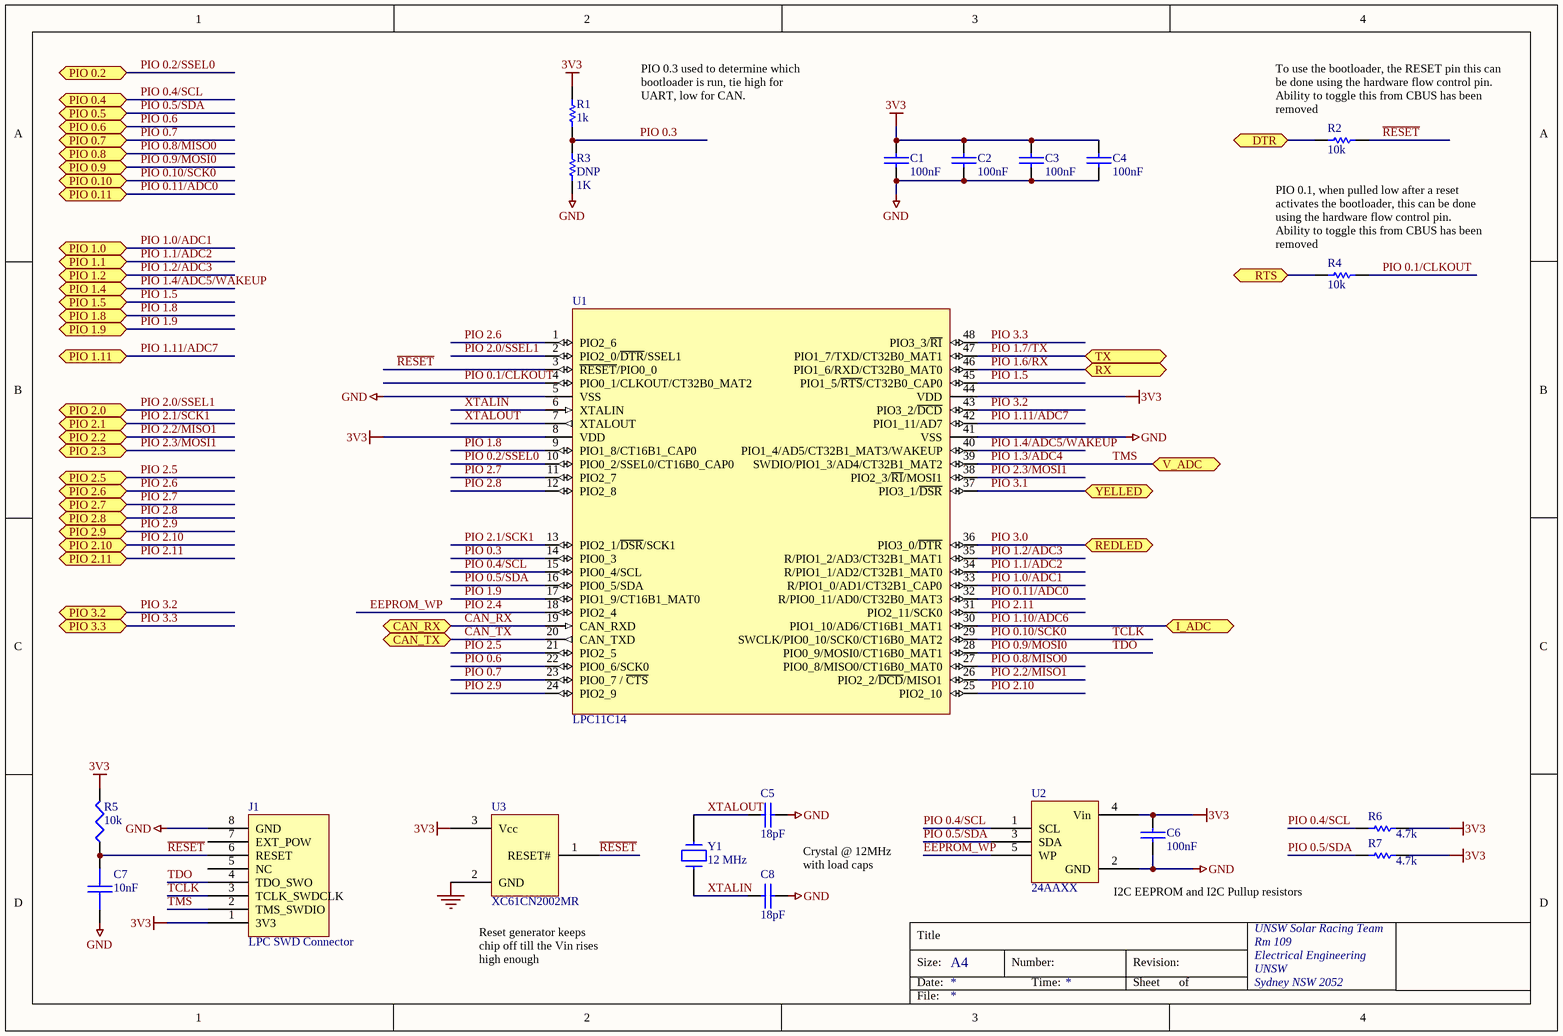
[diagram p4: lpc11c14.SchDoc]

### Parts
C1  100nF  [0603]
C2  100nF  [0603]
C3  100nF  [0603]
C4  100nF  [0603]
C5  18pF  [0603]
C6  100nF  [0603]
C7  10nF  [0603]
C8  18pF  [0603]
J1  LPC SWD Connector  [IDC8]
R1  1k  [0603]
R2  10k  [0603]
R3  DNP  value 1K  [0603]
R4  10k  [0603]
R5  10k  [0603]
R6  4.7k  [0603]
R7  4.7k  [0603]
U1  LPC11C14  [QFP48]
U2  24AAXX  [SOT23-5]
U3  XC61CN2002MR  [SOT23-3]
Y1  12 MHz  [HC49/4H]

### Ports
CAN_RX, CAN_TX, DTR, I_ADC, PIO 0.2, PIO 0.4, PIO 0.5, PIO 0.6, PIO 0.7, PIO 0.8, PIO 0.9, PIO 0.10, PIO 0.11, PIO 1.0, PIO 1.1, PIO 1.2, PIO 1.4, PIO 1.5, PIO 1.8, PIO 1.9, PIO 1.11, PIO 2.0, PIO 2.1, PIO 2.2, PIO 2.3, PIO 2.5, PIO 2.6, PIO 2.7, PIO 2.8, PIO 2.9, PIO 2.10, PIO 2.11, PIO 3.2, PIO 3.3, REDLED (bidir), RTS, RX, TX, V_ADC, YELLED (bidir)

### Nets
3V3: C1.1 C2.1 C3.1 C4.1 C6.1 J1.1(3V3) R1.2 R5.2 R6.2 R7.2 U1.8(VDD) U1.44(VDD) U2.4(Vin) U3.3(Vcc)
GND: C1.2 C2.2 C3.2 C4.2 C5.2 C6.2 C7.2 C8.2 J1.8(GND) R3.1 U1.5(VSS) U1.41(VSS) U2.2(GND) U3.2(GND)
CAN_RX: U1.19(CAN_RXD) ; port CAN_RX
CAN_TX: U1.20(CAN_TXD) ; port CAN_TX
DTR: R2.1 ; port DTR
EEPROM_WP: U1.18(PIO2_4) U2.5(WP)  [also labelled PIO 2.4]
PIO 0.1/CLKOUT: R4.2 U1.4(PIO0_1/CLKOUT/CT32B0_MAT2)
PIO 0.2/SSEL0: U1.10(PIO0_2/SSEL0/CT16B0_CAP0) ; port PIO 0.2
PIO 0.3: R1.1 R3.2 U1.14(PIO0_3)
PIO 0.4/SCL: R6.1 U1.15(PIO0_4/SCL) U2.1(SCL) ; port PIO 0.4
PIO 0.5/SDA: R7.1 U1.16(PIO0_5/SDA) U2.3(SDA) ; port PIO 0.5
PIO 0.6: U1.22(PIO0_6/SCK0) ; port PIO 0.6
PIO 0.7: U1.23(PIO0_7_/_~{CTS}) ; port PIO 0.7
PIO 0.8/MISO0: U1.27(PIO0_8/MISO0/CT16B0_MAT0) ; port PIO 0.8
PIO 0.9/MOSI0: J1.4(TDO_SWO) U1.28(PIO0_9/MOSI0/CT16B0_MAT1) ; port PIO 0.9  [also labelled TDO]
PIO 0.10/SCK0: J1.3(TCLK_SWDCLK) U1.29(SWCLK/PIO0_10/SCK0/CT16B0_MAT2) ; port PIO 0.10  [also labelled TCLK]
PIO 0.11/ADC0: U1.32(R/PIO0_11/AD0/CT32B0_MAT3) ; port PIO 0.11
PIO 1.0/ADC1: U1.33(R/PIO1_0/AD1/CT32B1_CAP0) ; port PIO 1.0
PIO 1.1/ADC2: U1.34(R/PIO1_1/AD2/CT32B1_MAT0) ; port PIO 1.1
PIO 1.2/ADC3: U1.35(R/PIO1_2/AD3/CT32B1_MAT1) ; port PIO 1.2
PIO 1.3/ADC4: J1.2(TMS_SWDIO) U1.39(SWDIO/PIO1_3/AD4/CT32B1_MAT2) ; port V_ADC  [also labelled TMS]
PIO 1.4/ADC5/WAKEUP: U1.40(PIO1_4/AD5/CT32B1_MAT3/WAKEUP) ; port PIO 1.4
PIO 1.5: U1.45(PIO1_5/~{RTS}/CT32B0_CAP0) ; port PIO 1.5
PIO 1.6/RX: U1.46(PIO1_6/RXD/CT32B0_MAT0) ; port RX
PIO 1.7/TX: U1.47(PIO1_7/TXD/CT32B0_MAT1) ; port TX
PIO 1.8: U1.9(PIO1_8/CT16B1_CAP0) ; port PIO 1.8
PIO 1.9: U1.17(PIO1_9/CT16B1_MAT0) ; port PIO 1.9
PIO 1.10/ADC6: U1.30(PIO1_10/AD6/CT16B1_MAT1) ; port I_ADC
PIO 1.11/ADC7: U1.42(PIO1_11/AD7) ; port PIO 1.11
PIO 2.0/SSEL1: U1.2(PIO2_0/~{DTR}/SSEL1) ; port PIO 2.0
PIO 2.1/SCK1: U1.13(PIO2_1/~{DSR}/SCK1) ; port PIO 2.1
PIO 2.2/MISO1: U1.26(PIO2_2/~{DCD}/MISO1) ; port PIO 2.2
PIO 2.3/MOSI1: U1.38(PIO2_3/~{RI}/MOSI1) ; port PIO 2.3
PIO 2.5: U1.21(PIO2_5) ; port PIO 2.5
PIO 2.6: U1.1(PIO2_6) ; port PIO 2.6
PIO 2.7: U1.11(PIO2_7) ; port PIO 2.7
PIO 2.8: U1.12(PIO2_8) ; port PIO 2.8
PIO 2.9: U1.24(PIO2_9) ; port PIO 2.9
PIO 2.10: U1.25(PIO2_10) ; port PIO 2.10
PIO 2.11: U1.31(PIO2_11/SCK0) ; port PIO 2.11
PIO 3.0: U1.36(PIO3_0/~{DTR}) ; port REDLED
PIO 3.1: U1.37(PIO3_1/~{DSR}) ; port YELLED
PIO 3.2: U1.43(PIO3_2/~{DCD}) ; port PIO 3.2
PIO 3.3: U1.48(PIO3_3/~{RI}) ; port PIO 3.3
~{RESET}: C7.1 J1.6(RESET) R2.2 R5.1 U1.3(~{RESET}/PIO0_0) U3.1(RESET#)
RTS: R4.1 ; port RTS
XTALIN: C8.1 U1.6(XTALIN) Y1.1
XTALOUT: C5.1 U1.7(XTALOUT) Y1.2

Not connected (* = marked no-connect by the designer): J1 5(NC) 7(EXT_POW)

### Channels
U_lpc_telem/U_lpc11c14: designators end in _U_lpc_telem_U_lpc11c14; ports CAN_RX=CAN_RX CAN_TX=CAN_TX DTR=NetR2_U_lpc_telem_U_lpc11c14_1 I_ADC=PIO 1.10/ADC6 PIO 0.2=PIO 0.2/SSEL0_U_lpc11c14 PIO 0.4=PIO 0.4/SCL_U_lpc11c14 PIO 0.5=PIO 0.5/SDA_U_lpc11c14 PIO 0.6=PIO 0.6_U_lpc11c14 PIO 0.7=PIO 0.7_U_lpc11c14 PIO 0.8=PIO 0.8/MISO0_U_lpc11c14 PIO 0.9=PIO 0.9/MOSI0_U_lpc11c14 PIO 0.10=PIO 0.10/SCK0_U_lpc11c14 PIO 0.11=PIO 0.11/ADC0_U_lpc11c14 PIO 1.0=PIO 1.0/ADC1_U_lpc11c14 PIO 1.1=PIO 1.1/ADC2_U_lpc11c14 PIO 1.2=PIO 1.2/ADC3_U_lpc11c14 PIO 1.4=PIO 1.4/ADC5/WAKEUP_U_lpc11c14 PIO 1.5=PIO 1.5_U_lpc11c14 PIO 1.8=PIO 1.8_U_lpc11c14 PIO 1.9=PIO 1.9_U_lpc11c14 PIO 1.11=PIO 1.11/ADC7_U_lpc11c14 PIO 2.0=PIO 2.0/SSEL1 PIO 2.1=PIO 2.1/SCK1 PIO 2.2=PIO 2.2/MISO1 PIO 2.3=PIO 2.3/MOSI1 PIO 2.5=PIO 2.5_U_lpc11c14 PIO 2.6=PIO 2.6_U_lpc11c14 PIO 2.7=PIO 2.7_U_lpc11c14 PIO 2.8=PIO 2.8_U_lpc11c14 PIO 2.9=PIO 2.9_U_lpc11c14 PIO 2.10=PIO 2.10_U_lpc11c14 PIO 2.11=PIO 2.11_U_lpc11c14 PIO 3.2=PIO 3.2 PIO 3.3=PIO 3.3 REDLED=PIO 3.0 RTS=NetR4_U_lpc_telem_U_lpc11c14_1 RX=PIO 1.6/RX TX=PIO 1.7/TX V_ADC=PIO 1.3/ADC4 YELLED=PIO 3.1
U_lpc_ws/U_lpc11c14: designators end in _U_lpc_ws_U_lpc11c14; ports CAN_RX=CAN_RX CAN_TX=CAN_TX DTR=NetR2_U_lpc_ws_U_lpc11c14_1 I_ADC=PIO 1.10/ADC6_U_lpc11c14 PIO 0.2=PIO 0.2/SSEL0 PIO 0.4=PIO 0.4/SCL PIO 0.5=PIO 0.5/SDA PIO 0.6=PIO 0.6 PIO 0.7=PIO 0.7 PIO 0.8=PIO 0.8/MISO0 PIO 0.9=PIO 0.9/MOSI0 PIO 0.10=PIO 0.10/SCK0 PIO 0.11=PIO 0.11/ADC0 PIO 1.0=PIO 1.0/ADC1 PIO 1.1=PIO 1.1/ADC2 PIO 1.2=PIO 1.2/ADC3 PIO 1.4=PIO 1.4/ADC5/WAKEUP PIO 1.5=PIO 1.5 PIO 1.8=PIO 1.8 PIO 1.9=PIO 1.9 PIO 1.11=PIO 1.11/ADC7 PIO 2.0=PIO 2.0/SSEL1 PIO 2.1=PIO 2.1/SCK1 PIO 2.2=PIO 2.2/MISO1 PIO 2.3=PIO 2.3/MOSI1 PIO 2.5=PIO 2.5 PIO 2.6=PIO 2.6 PIO 2.7=PIO 2.7 PIO 2.8=PIO 2.8 PIO 2.9=PIO 2.9 PIO 2.10=PIO 2.10 PIO 2.11=PIO 2.11 PIO 3.2=PIO 3.2 PIO 3.3=PIO 3.3 REDLED=PIO 3.0 RTS=NetR4_U_lpc_ws_U_lpc11c14_1 RX=PIO 1.6/RX TX=PIO 1.7/TX V_ADC=PIO 1.3/ADC4_U_lpc11c14 YELLED=PIO 3.1

### Notes on the sheet
- PIO 0.3 used to determine which bootloader is run, tie high for UART, low for CAN.
- (near R2) To use the bootloader, the RESET pin this can be done using the hardware flow control pin.
  Ability to toggle this from CBUS has been removed
- (near C2) Text
- PIO 0.1, when pulled low after a reset activates the bootloader, this can be done using the hardware flow control pin.
  Ability to toggle this from CBUS has been removed
- Crystal @ 12MHz with load caps
- (near U2) I2C EEPROM and I2C Pullup resistors
- (near U3) Reset generator keeps chip off till the Vin rises high enough
- Title
- Size:
- Date:
- A4
- Number:
- Time:
- Revision:
- Sheet
- of
- File:

### Library data of the parts
C1-C4 C6 C7 = CAP: Capacitor; Needed?: NO - HW LAB
  C1-C4 C6: Value: 100nF
  C7: Value: 10nF
C5 C8 = CAP: Capacitor; Manufacturer: Kemet; Manufacturer Part Number: CBR06C180FAGAC; Needed?: Farnell; Description: CAP CER 18PF 250V 1% NP0 0603; Voltage - Rated: 250V; Tolerance: ±1%; Temperature Coefficient: C0G, NP0; Value: 18pF; Farnell: 1844169; Farnell Price: 0.025; Supplier 1: Digi-Key; Supplier Part Number 1: 399-8842-1-ND; RoHS: RoHS Compliant; Category: Capacitors; Stock 1: 1121; Pricing 1: 1=0.85, 10=0.811, 50=0.4846, 100=0.3937, 250=0.32708, 500=0.2968, 1000=0.27257 (AUD); Packaging: Cut Tape (CT); Capacitance: 18pF; Mounting Type: Surface Mount, MLCC; Operating Temperature: -55°C ~ 125°C; Applications: RF, Microwave, High Frequency; Ratings: -; Package / Case: 0603 (1608 Metric); Size / Dimension: 0.063" L x 0.031" W (1.60mm x 0.80mm); Height - Seated (Max): -; Thickness (Max): 0.034" (0.87mm); Lead Spacing: -; Features: High Q, Low Loss; Lead Style: -; ComponentLink1URL: http://www.kemet.com/kemet/web/homepage/kechome.nsf/file/E8E10945B57BE93285257989006DD493/$file/KEM_C1030_CBR_SMD.pdf; ComponentLink1Description: http://www.kemet.com/kemet/web/homepage/kechome.nsf/file/E8E10945B57BE93285257989006DD493/$file/KEM_C1030_CBR_SMD.pdf
J1 = LPCLink_Connector: Needed?: NO - Common
R1-R4 R6 R7 = Res Semi: Semiconductor Resistor; Published: 8-Jun-2000; LatestRevisionDate: 17-Jul-2002; LatestRevisionNote: Re-released for DXP Platform.; PackageReference: AXIAL-0.5; Publisher: Altium Limited; PackageDescription: Axial Device, Thru-Hole; 2 Leads; 0.5 in Pin Spacing
  R1: Value: 1K
  R2 R4: Value: 10k
  R6 R7: Value: 4.7k
R5 = RES1: Resistor; Needed?: NO - HW LAB; Value: 10k
U1 = LPC11C14_Full: NXP LPC11C14 Microcontroller; Farnell: NA
U2 = 24AAXX: I2C EEPROM for SOT23-5 package
U3 = XC61F: SOT23 reset generator; Needed?: Farnell; Farnell: 3605486; Farnell Price: 1.74
Y1 = CRYSTAL: Needed?: RS; RS: 693-8803; RS Price: 0.95

## Sheet lpc_ws.SchDoc
size A4
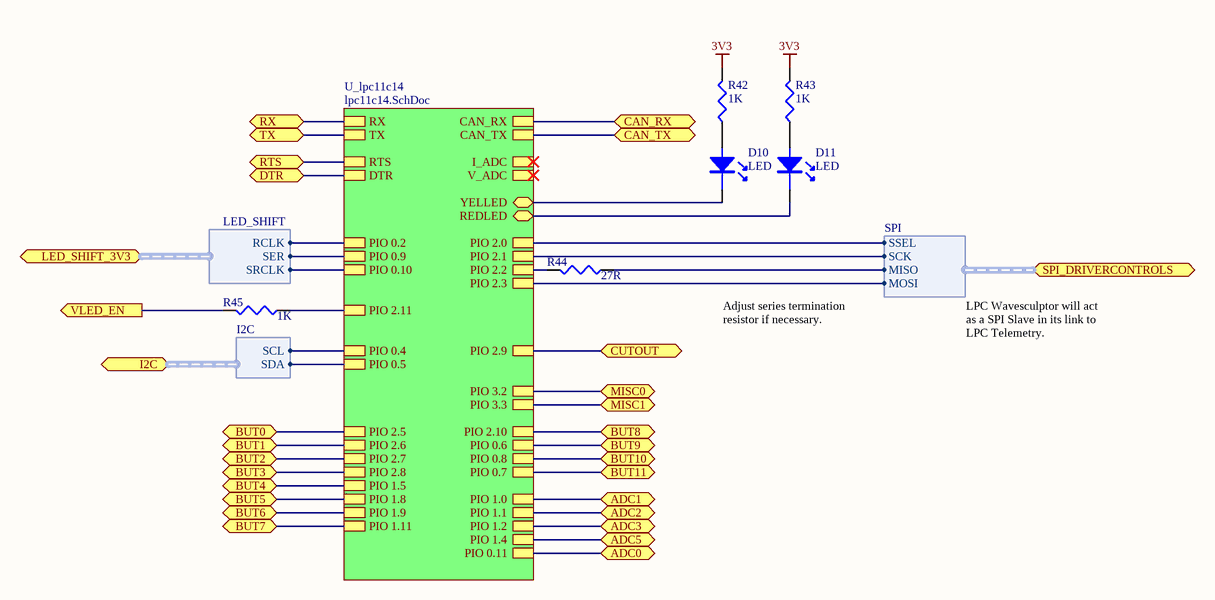
[diagram p5: lpc_ws.SchDoc]

### Parts
D10  LED  [0805LED]
D11  LED  [0805LED]
R42  1K  [0603]
R43  1K  [0603]
R44  27R  [0603]
R45  1K  [0603]

### Sub-sheets
U_lpc11c14 = lpc11c14.SchDoc: TX, RX, CAN_RX, CAN_TX, RTS, DTR, YELLED (bidir), REDLED (bidir), I_ADC, V_ADC, PIO 2.1, PIO 2.5, PIO 2.9, PIO 2.10, PIO 2.2, PIO 0.8, PIO 0.9, PIO 0.10, PIO 2.11, PIO 0.11, PIO 1.0, PIO 1.1, PIO 1.2, PIO 2.3, PIO 1.4, PIO 3.2, PIO 1.5, PIO 3.3, PIO 0.2, PIO 0.4, PIO 0.5, PIO 0.6, PIO 0.7, PIO 2.6, PIO 2.0, PIO 2.7, PIO 2.8, PIO 1.8, PIO 1.9, PIO 1.11

### Ports
ADC0, ADC1, ADC2, ADC3, ADC5, BUT0, BUT1, BUT2, BUT3, BUT4, BUT5, BUT6, BUT7, BUT8, BUT9, BUT10, BUT11, CAN_RX, CAN_TX, CUTOUT, DTR, I2C (harness I2C), LED_SHIFT_3V3 (harness LED_SHIFT), MISC0, MISC1, RTS, RX, SPI_DRIVERCONTROLS (harness SPI), TX, VLED_EN (out)

### Harnesses
SPI: SSEL, SCK, MOSI, MISO
LED_SHIFT: RCLK, SER, SRCLK
I2C: SCL, SDA

### Nets
3V3: R42.2 R43.2
CAN_RX: port CAN_RX, sheet U_lpc11c14/CAN_RX
CAN_TX: port CAN_TX, sheet U_lpc11c14/CAN_TX
PIO 0.2/SSEL0: sheet U_lpc11c14/PIO 0.2, port LED_SHIFT_3V3.RCLK
PIO 0.4/SCL: sheet U_lpc11c14/PIO 0.4, port I2C.SCL
PIO 0.5/SDA: sheet U_lpc11c14/PIO 0.5, port I2C.SDA
PIO 0.6: port BUT9, sheet U_lpc11c14/PIO 0.6
PIO 0.7: port BUT11, sheet U_lpc11c14/PIO 0.7
PIO 0.8/MISO0: port BUT10, sheet U_lpc11c14/PIO 0.8
PIO 0.9/MOSI0: sheet U_lpc11c14/PIO 0.9, port LED_SHIFT_3V3.SER
PIO 0.10/SCK0: sheet U_lpc11c14/PIO 0.10, port LED_SHIFT_3V3.SRCLK
PIO 0.11/ADC0: port ADC0, sheet U_lpc11c14/PIO 0.11
PIO 1.0/ADC1: port ADC1, sheet U_lpc11c14/PIO 1.0
PIO 1.1/ADC2: port ADC2, sheet U_lpc11c14/PIO 1.1
PIO 1.2/ADC3: port ADC3, sheet U_lpc11c14/PIO 1.2
PIO 1.4/ADC5/WAKEUP: port ADC5, sheet U_lpc11c14/PIO 1.4
PIO 1.5: port BUT4, sheet U_lpc11c14/PIO 1.5
PIO 1.6/RX: port RX, sheet U_lpc11c14/RX
PIO 1.7/TX: port TX, sheet U_lpc11c14/TX
PIO 1.8: port BUT5, sheet U_lpc11c14/PIO 1.8
PIO 1.9: port BUT6, sheet U_lpc11c14/PIO 1.9
PIO 1.11/ADC7: port BUT7, sheet U_lpc11c14/PIO 1.11
PIO 2.0/SSEL1: sheet U_lpc11c14/PIO 2.0, port SPI_DRIVERCONTROLS.SSEL
PIO 2.1/SCK1: sheet U_lpc11c14/PIO 2.1, port SPI_DRIVERCONTROLS.SCK
PIO 2.2/MISO1: R44.1 ; port SPI_DRIVERCONTROLS.MISO
PIO 2.2/MISO1: R44.2 ; sheet U_lpc11c14/PIO 2.2  [a separate net that carries the same name]
PIO 2.3/MOSI1: sheet U_lpc11c14/PIO 2.3, port SPI_DRIVERCONTROLS.MOSI
PIO 2.5: port BUT0, sheet U_lpc11c14/PIO 2.5
PIO 2.6: port BUT1, sheet U_lpc11c14/PIO 2.6
PIO 2.7: port BUT2, sheet U_lpc11c14/PIO 2.7
PIO 2.8: port BUT3, sheet U_lpc11c14/PIO 2.8
PIO 2.9: port CUTOUT, sheet U_lpc11c14/PIO 2.9
PIO 2.10: port BUT8, sheet U_lpc11c14/PIO 2.10
PIO 2.11: R45.1 ; sheet U_lpc11c14/PIO 2.11
PIO 3.0: D11.K ; sheet U_lpc11c14/REDLED
PIO 3.1: D10.K ; sheet U_lpc11c14/YELLED
PIO 3.2: port MISC0, sheet U_lpc11c14/PIO 3.2
PIO 3.3: port MISC1, sheet U_lpc11c14/PIO 3.3
VLED_EN: R45.2 ; port VLED_EN
NetD10_A: D10.A R42.1
NetD11_A: D11.A R43.1
NetR2_U_lpc_ws_U_lpc11c14_1: port DTR, sheet U_lpc11c14/DTR
NetR4_U_lpc_ws_U_lpc11c14_1: port RTS, sheet U_lpc11c14/RTS

### Notes on the sheet
- Adjust series termination resistor if necessary.
- LPC Wavesculptor will act as a SPI Slave in its link to LPC Telemetry.

### Library data of the parts
D10 = LED: as D8 on sheet lpc_telem; Supplier 1: Digi-Key; Supplier Part Number 1: 475-2560-1-ND; RoHS: RoHS Compliant; Category: Optoelectronics; Stock 1: 42136; Pricing 1: 1=0.14, 10=0.112, 100=0.0892, 250=0.07804, 500=0.07132 (AUD); Packaging: Cut Tape (CT); Package / Case: 0805 (2012 Metric); Size / Dimension: 2.00mm L x 1.25mm W; Height: 0.80mm; Mounting Type: Surface Mount; ComponentLink1URL: http://catalog.osram-os.com/jsp/download.jsp?name=LO_LS_LY_R976.pdf&url=/media/_en/Graphics/00042116_0.pdf; ComponentLink1Description: http://catalog.osram-os.com/jsp/download.jsp?name=LO_LS_LY_R976.pdf&url=/media/_en/Graphics/00042116_0.pdf
D11 = LED: as D9 on sheet lpc_telem; Supplier 1: Digi-Key; Supplier Part Number 1: 475-1278-1-ND; RoHS: RoHS Compliant; Category: Optoelectronics; Stock 1: 53912; Pricing 1: 1=0.14, 10=0.112, 100=0.0892, 250=0.07804, 500=0.07132 (AUD); Packaging: Cut Tape (CT); Package / Case: 0805 (2012 Metric); Size / Dimension: 2.00mm L x 1.25mm W; Height: 0.80mm; Mounting Type: Surface Mount; ComponentLink1URL: http://catalog.osram-os.com/jsp/download.jsp?name=LO_LS_LY_R976.pdf&url=/media/_en/Graphics/00042116_0.pdf; ComponentLink1Description: http://catalog.osram-os.com/jsp/download.jsp?name=LO_LS_LY_R976.pdf&url=/media/_en/Graphics/00042116_0.pdf
R42 R43 = RES1: Resistor
R44 = RES1: as R39 on sheet lpc_telem; Supplier 1: Digi-Key; Supplier Part Number 1: P27.0HCT-ND; RoHS: RoHS Compliant; Category: Resistors; Stock 1: 89523; Pricing 1: 1=0.12, 50=0.0166, 100=0.0126, 250=0.00936, 500=0.00692, 1000=0.00461 (AUD); Packaging: Cut Tape (CT); Composition: Thick Film; Features: -; Package / Case: 0603 (1608 Metric); Supplier Device Package: 0603; Size / Dimension: 0.063" L x 0.031" W (1.60mm x 0.80mm); Height: 0.022" (0.55mm); Number of Terminations: 2; ComponentLink1URL: http://industrial.panasonic.com/www-cgi/jvcr13pz.cgi?E+PZ+3+AOA0002+ERJ3EKF27R0V+7+WW; ComponentLink1Description: http://industrial.panasonic.com/www-cgi/jvcr13pz.cgi?E+PZ+3+AOA0002+ERJ3EKF27R0V+7+WW
R45 = RES1: Resistor; Value: 20k; Needed?: NO - HW LAB